# Altium project Control_Board_Model_C201.PrjPcb (part 2 of 8)

## Sheet MCU_Module.SchDoc: MCU Module
size A4; DocumentNumber: 4; SheetNumber: 4; SheetTotal: 50
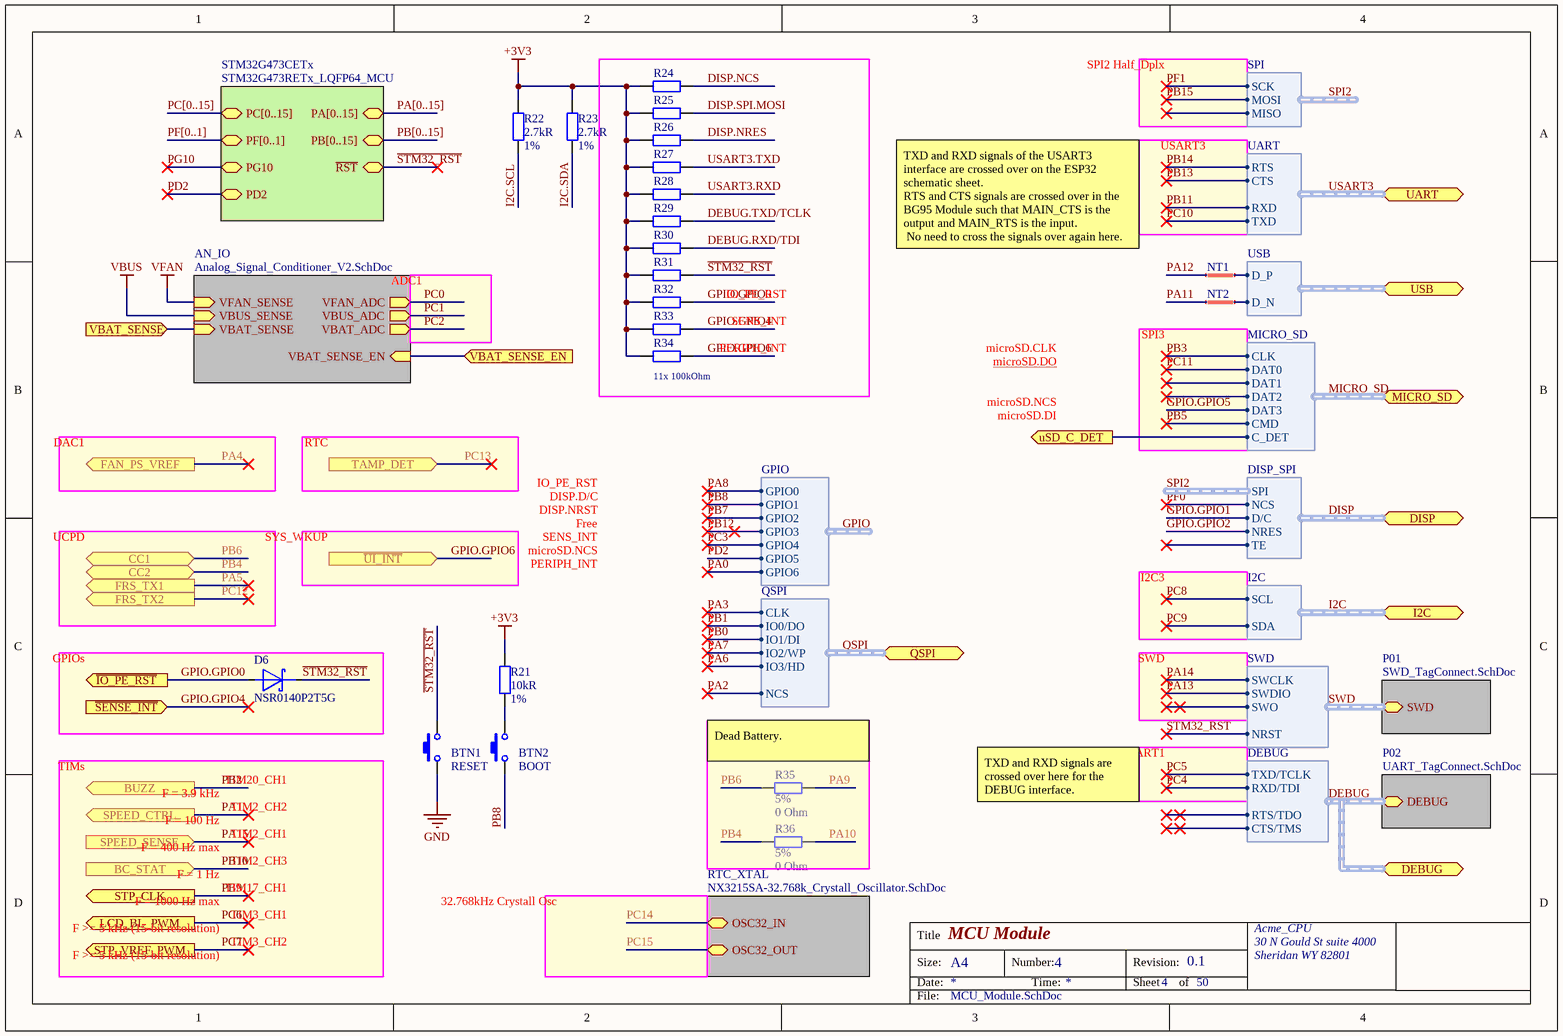
[diagram p3: MCU_Module.SchDoc]

### Parts
BTN1  RESET  [SWITCH USLPT2819DT2TR TACTILE TE]
BTN2  BOOT  [SWITCH USLPT2819DT2TR TACTILE TE]
D6  NSR0140P2T5G  [SODFL100X40-2N]
NT1  Net Tie  [Net Tie 6x30mil]  (value not drawn)  (net tie, no BOM)
NT2  Net Tie  [Net Tie 6x30mil]  (value not drawn)  (net tie, no BOM)
R21  Resistance: 10kR  Tolerance: 1%  [R0402]  (hidden comment: RES SMD 10K OHM 1% 1/16W 0402)
R22  Resistance: 2.7kR  Tolerance: 1%  [R0402]  (hidden comment: RES SMD 2.7K OHM 1% 1/16W 0402)
R23  Resistance: 2.7kR  Tolerance: 1%  [R0402]  (hidden comment: RES SMD 2.7K OHM 1% 1/16W 0402)
R24  RES SMD 100K OHM 1% 1/16W 0402  [R0402]  (value not drawn)
R25  RES SMD 100K OHM 1% 1/16W 0402  [R0402]  (value not drawn)
R26  RES SMD 100K OHM 1% 1/16W 0402  [R0402]  (value not drawn)
R27  RES SMD 100K OHM 1% 1/16W 0402  [R0402]  (value not drawn)
R28  RES SMD 100K OHM 1% 1/16W 0402  [R0402]  (value not drawn)
R29  RES SMD 100K OHM 1% 1/16W 0402  [R0402]  (value not drawn)
R30  RES SMD 100K OHM 1% 1/16W 0402  [R0402]  (value not drawn)
R31  RES SMD 100K OHM 1% 1/16W 0402  [R0402]  (value not drawn)
R32  RES SMD 100K OHM 1% 1/16W 0402  [R0402]  (value not drawn)
R33  RES SMD 100K OHM 1% 1/16W 0402  [R0402]  (value not drawn)
R34  RES SMD 100K OHM 1% 1/16W 0402  [R0402]  (value not drawn)
R35  Tolerance: 5%  Resistance: 0 Ohm  [R0402]  (hidden comment: RES SMD 0 OHM JUMPER 1/16W 0402)
R36  Tolerance: 5%  Resistance: 0 Ohm  [R0402]  (hidden comment: RES SMD 0 OHM JUMPER 1/16W 0402)

### Blocks framed on the sheet
GPIOs: D6

### Sub-sheets
AN_IO = Analog_Signal_Conditioner_V2.SchDoc: VFAN_SENSE (in), VBUS_SENSE (in), VBAT_SENSE (in), VBAT_ADC (out), VFAN_ADC (out), VBUS_ADC (out), VBAT_SENSE_EN (in)
P01 = SWD_TagConnect.SchDoc: SWD (harness SWD)  | Caption: SWD
P02 = UART_TagConnect.SchDoc (file not in this document): DEBUG (harness DEBUG)  | Caption: DEBUG
RTC_XTAL = NX3215SA-32.768k_Crystall_Oscillator.SchDoc: OSC32_OUT, OSC32_IN
STM32G473CETx = STM32G473RETx_LQFP64_MCU (file not in this document): ~{RST} (bidir), PA[0..15] (bidir), PB[0..15] (bidir), PC[0..15] (bidir), PF[0..1] (bidir), PG10 (bidir), PD2 (bidir)

### Ports
BC_STAT (in), BUZZ (out), CC1 (bidir), CC2 (bidir), DEBUG (harness DEBUG), DISP (harness DISP_SPI), FAN_PS_VREF (out), FRS_TX1 (out), FRS_TX2 (out), I2C (harness I2C), LCD_BL_PWM (out), MICRO_SD (harness MICRO_SD), QSPI (harness QSPI), SPEED_CTRL (out), SPEED_SENSE (in), STP_CLK (out), STP_VREF_PWM (out), TAMP_DET (in), UART (harness UART), USB (harness USB), uSD_C_DET (out), VBAT_SENSE (in), VBAT_SENSE_EN (in), ~{IO_PE_RST} (out), ~{SENSE_INT} (in), ~{UI_INT} (in)

### Harnesses
I2C: SCL, SDA
SWD: SWDIO, SWCLK, NRST, SWO
DEBUG: TXD/TCLK, RXD/TDI, RTS/TDO, CTS/TMS
GPIO: GPIO0, GPIO1, GPIO2, GPIO3, GPIO4, GPIO5, GPIO6
DISP_SPI: SPI, NCS, D/C, NRES, TE
MICRO_SD: DAT0, DAT1, DAT2, DAT3, CMD, CLK, C_DET
USB: D_P, D_N
SPI: SCK, MISO, MOSI
QSPI: IO0/DO, IO1/DI, NCS, CLK, IO2/WP, IO3/HD
UART: RTS, CTS, RXD, TXD

### Nets
+3V3: R21.1 R22.2 R23.2 R24.1 R25.1 R26.1 R27.1 R28.1 R29.1 R30.1 R31.1 R32.1 R33.1 R34.1
GND: BTN1.2
~{STM32_RST}: BTN1.1 D6.1(K) R31.2 ; sheet STM32G473CETx/~{RST}, sheet P01/SWD.NRST
DEBUG.RXD/TDI: R30.2
DEBUG.TXD/TCLK: R29.2
DIO_1_1: port uSD_C_DET, port MICRO_SD.C_DET
DIO_1_9: port VBAT_SENSE_EN, sheet AN_IO/VBAT_SENSE_EN
DISP.NCS: R24.2
DISP.NRES: R26.2
DISP.SPI.MOSI: R25.2
GPIO.GPIO0: D6.2(A) R32.2 ; port ~{IO_PE_RST}  [project net ~{IO_PE_RST}]
GPIO.GPIO1: port DISP.D/C  [project net DISP.D/C]
GPIO.GPIO2: port DISP.NRES  [project net DISP.NRES]
GPIO.GPIO4: R33.2 ; port ~{SENSE_INT}  [project net ~{SENS_INT}]
GPIO.GPIO5: port MICRO_SD.DAT3
GPIO.GPIO6: R34.2 ; port ~{UI_INT}  [project net ~{IO_SYS_INT}]
I2C.SCL: R22.1
I2C.SDA: R23.1
PA0: harness GPIO.GPIO6  [project net GPIO.GPIO6]
PA2: port QSPI.NCS
PA3: port QSPI.CLK
PA4: port FAN_PS_VREF  [project net FAN_PS_CTRL]
PA6: port QSPI.IO3/HD
PA7: port QSPI.IO2/WP
PA8: harness GPIO.GPIO0  [project net GPIO.GPIO0]
PA9: R35.2
PA10: R36.2
PA11: NT2.1
PA12: NT1.1
PA13: sheet P01/SWD.SWDIO
PA14: sheet P01/SWD.SWCLK
PB0: port QSPI.IO1/DI
PB1: port QSPI.IO0/DO
PB3: port MICRO_SD.CLK  [project net MICRO_SD.CLK]
PB4: R36.1 ; port CC2  [project net CC2]
PB5: port MICRO_SD.CMD  [project net MICRO_SD.CMD]
PB6: R35.1 ; port CC1  [project net CC1]
PB7: harness GPIO.GPIO2  [project net GPIO.GPIO2]
PB8: BTN2.2 ; harness GPIO.GPIO1  [project net GPIO.GPIO1]
PB9: port STP_CLK
PB11: port UART.RXD  [project net GPIO17]
PB12: harness GPIO.GPIO3  [project net GPIO.GPIO3]
PB13: port UART.CTS
PB14: port UART.RTS
PB15: harness SPI.MOSI
PC3: harness GPIO.GPIO4  [project net GPIO.GPIO4]
PC4: port DEBUG.RXD/TDI  [project net DEBUG.RXD/TDI]
PC5: port DEBUG.TXD/TCLK  [project net DEBUG.TXD/TCLK]
PC6: port LCD_BL_PWM  [project net LCD_BL_PWM]
PC7: port STP_VREF_PWM
PC8: port I2C.SCL  [project net GPIO4]
PC9: port I2C.SDA  [project net GPIO18]
PC10: port UART.TXD  [project net GPIO16]
PC11: port MICRO_SD.DAT0  [project net MICRO_SD.DAT0]
PD2: sheet STM32G473CETx/PD2, harness GPIO.GPIO5  [project net GPIO.GPIO5]
PF0: port DISP.NCS  [project net DISP.NCS]
PF1: harness SPI.SCK
PG10: sheet STM32G473CETx/PG10
USART3.RXD: R28.2
USART3.TXD: R27.2
USB1.D_N: NT2.2 ; port USB.D_N
USB1.D_P: NT1.2 ; port USB.D_P
VBAT: port VBAT_SENSE, sheet AN_IO/VBAT_SENSE
NetBTN2_1: BTN2.1 R21.2

### Buses and harness runs
bus PA[0..15] = sheet STM32G473CETx/PA[0..15]
bus PB[0..15] = sheet STM32G473CETx/PB[0..15]
bus PC[0..15] = sheet STM32G473CETx/PC[0..15]
bus PF[0..1] = sheet STM32G473CETx/PF[0..1]
harness DEBUG = port DEBUG = sheet P02/DEBUG
harness DISP = port DISP
harness I2C = port I2C
harness MICRO_SD = port MICRO_SD
harness QSPI = port QSPI
harness SWD = sheet P01/SWD
harness USART3 = port UART

### Notes on the sheet
- SPI2 Half_Dplx
- USART3
- TXD and RXD signals of the USART3 interface are crossed over on the ESP32 schematic sheet.
  RTS and CTS signals are crossed over in the BG95 Module such that MAIN_CTS is the output and MAIN_RTS is the input.
  No need to cross the signals over again here.
- ADC1
- IO_PE_RST
- (near R34) 11x 100kOhm
- PERIPH_INT
- SENS_INT
- microSD.CLK
- microSD.DO
- (near NT2) SPI3
- DAC1
- RTC
- microSD.NCS
- microSD.DI
- DISP.D/C
- DISP.NRST
- UCPD
- SYS_WKUP
- Free
- I2C3
- SWD
- TIMs
- TIM20_CH1
- (near R35) Dead Battery.
- USART1
- F = 3.9 kHz
- F = 100 Hz
- F = 400 Hz max
- TIM2_CH1
- TIM2_CH2
- TXD and RXD signals are crossed over here for the DEBUG interface.
- F = 1000 Hz max
- F = 1 Hz
- TIM17_CH1
- TIM3_CH1
- TIM2_CH3
- 32.768kHz Crystall Osc
- F >= 5 kHz (15-bit resolution)
- TIM3_CH2
- Title
- Size:
- Date:
- A4
- Number:
- Time:
- Revision:
- Sheet
- of
- File:

### Library data of the parts
BTN1 BTN2 = TACT ULTRA TB 2.8X1.9X0.6 160GF: Tactile Switch SPST-NO Top Actuated Surface Mount; Manufacturer: TE Connectivity; Manufacturer Part Number: USLPT2819DT2TR; Mechanical Life: 300000Cycles; Operating Force: 160gf; Throw Configuration: SPST; Illumination Type: Non-Illuminated; Switch Travel: 0.13mm; Switch Function: Off-Mom; Actuator Type: Standard; Actuator Material: Nylon,Polyamide; Supplier 1: Digi-Key; Stock 1: 7628; Pricing 1: 1=0.66, 10=0.636, 25=0.612, 100=0.5297, 250=0.4826, 500=0.4473, 1000=0.4002, 2500=0.379 (USD); Mount: Surface Mount; Min Operating Temperature: -40°C; Max Operating Temperature: 85°C; Packaging: Tape and Reel; Termination: SMD/SMT; ComponentLink1URL: https://www.te.com/commerce/DocumentDelivery/DDEController?Action=srchrtrv&amp;DocNm=2337225&amp;DocType=Customer+Drawing&amp;DocLang=English&src-supplier=Digi-Key; ComponentLink1Description: https://www.te.com/commerce/DocumentDelivery/DDEController?Action=srchrtrv&amp;DocNm=2337225&amp;DocType=Customer+Drawing&amp;DocLang=English&src-supplier=Digi-Key; Supplier Part Number 1: 450-3358-1-ND
D6 = DIODE SCHOTTKY 30V 70MA SOD923: as D2 on sheet USB_Type-C_Port_V2.0; Supplier 1: Digi-Key; Manufacturer Part Number: NSR0140P2T5G; Stock 1: 28802; Pricing 1: 1=0.36, 10=0.27, 25=0.2368, 100=0.1284, 500=0.1048, 1000=0.0777, 2500=0.0683 (USD); Case/Package: SOD-923-2; Number of Pins: 2; Contact Plating: Tin,Matte; Min Operating Temperature: -55°C; Max Operating Temperature: 125°C; Forward Current: 70mA; Package Quantity: 1; Packaging: Tape and Reel; Average Rectified Current: 70mA; Max Repetitive Reverse Voltage (Vrrm): 30V; Peak Reverse Current: 500nA; Power Dissipation: 100mW; Peak Non-Repetitive Surge Current: 500mA; Max Forward Surge Current (Ifsm): 500mA; Termination: SMD/SMT; Max Reverse Voltage (DC): 30V; Length: 0.85mm; Height: 0.43mm; Width: 0.65mm; Radiation Hardening: No; REACH SVHC: No SVHC; Lead Free: Lead Free; ComponentLink1URL: http://www.onsemi.com/pub_link/Collateral/NSR0140P2-D.PDF?src-supplier=Future+Electronics; ComponentLink1Description: http://www.onsemi.com/pub_link/Collateral/NSR0140P2-D.PDF?src-supplier=Future+Electronics; ComponentLink2URL: http://www.farnell.com/datasheets/2353885.pdf?src-supplier=Newark; ComponentLink2Description: http://www.farnell.com/datasheets/2353885.pdf?src-supplier=Newark; ComponentLink3URL: http://www.farnell.com/datasheets/86281.pdf?src-supplier=Element14; ComponentLink3Description: http://www.farnell.com/datasheets/86281.pdf?src-supplier=Element14; ComponentLink4URL: http://www.onsemi.com/pub/Collateral/NSR0140P2-D.PDF?src-supplier=Avnet; ComponentLink4Description: http://www.onsemi.com/pub/Collateral/NSR0140P2-D.PDF?src-supplier=Avnet; ComponentLink5URL: http://www.onsemi.com/pub/Collateral/NSR0140P2-D.PDF?src-supplier=Digi-Key; ComponentLink5Description: http://www.onsemi.com/pub/Collateral/NSR0140P2-D.PDF?src-supplier=Digi-Key; ComponentLink6URL: http://www.mouser.com/ds/2/308/NSR0140P2-D-115172.pdf?src-supplier=Mouser; ComponentLink6Description: http://www.mouser.com/ds/2/308/NSR0140P2-D-115172.pdf?src-supplier=Mouser; Supplier Part Number 1: NSR0140P2T5GOSCT-ND; ClassName: STM32G473CETx; Mount: Surface Mount
NT1 NT2 = Net Tie Line: ClassName: STM32G473CETx
R21 = RES SMD 10K OHM 1% 1/16W 0402: 10 kOhms ±1% 0.063W, 1/16W Chip Resistor 0402 (1005 Metric) Moisture Resistant Thick Film; Manufacturer Part Number: RC0402FR-0710KP; Manufacturer: Yageo; Temperature Coefficient: 150ppm/°C; Max Power Dissipation: 63mW; Supplier 1: Digi-Key; Stock 1: 839368; Pricing 1: 1=0.1, 10=0.035, 100=0.014, 1000=0.0063, 2500=0.0055, 5000=0.0045 (USD); Case Code (Imperial): 0402; Case Code (Metric): 1005; Min Operating Temperature: -55°C; Max Operating Temperature: 155°C; Composition: Thick Film; Packaging: Tape and Reel; Number of Terminations: 2; Length: 0.039inch; Height: 0.016inch; Width: 0.02inch; ComponentLink1URL: http://www.yageo.com/NewPortal/yageodocoutput?fileName=/pdf/R-Chip/PYu-RC_51_RoHS_P_0.pdf&src-supplier=Digi-Key; ComponentLink1Description: http://www.yageo.com/NewPortal/yageodocoutput?fileName=/pdf/R-Chip/PYu-RC_51_RoHS_P_0.pdf&src-supplier=Digi-Key; Supplier Part Number 1: YAG1249CT-ND; Case/Package: 0402; Features: Moisture Resistant; ClassName: STM32G473CETx; Mount: Surface Mount
R22 R23 = RES SMD 2.7K OHM 1% 1/16W 0402: 2.7 kOhms ±1% 0.063W, 1/16W Chip Resistor 0402 (1005 Metric) Moisture Resistant Thick Film; Manufacturer: Yageo; Manufacturer Part Number: RC0402FR-072K7L; Power Rating: 63mW; Temperature Coefficient: 100ppm/°C; Voltage Rating: 50V; Supplier 1: Digi-Key; Stock 1: 261850; Pricing 1: 1=0.1, 10=0.016, 100=0.0064, 1000=0.0029, 2500=0.0025, 5000=0.0021 (USD); Case/Package: 0402; Case Code (Imperial): 0402; Case Code (Metric): 1005; Min Operating Temperature: -55°C; Max Operating Temperature: 155°C; Packaging: Tape and Reel; Package Quantity: 1; Termination: SMD/SMT; Composition: Thick Film; Number of Terminations: 2; Military Standard: Not; Max Power Dissipation: 63mW; Features: Moisture Resistant; Working Voltage: 50V; Length: 1mm; Height: 0.016inch; Width: 0.02inch; Depth: 0.5mm; REACH SVHC: Unknown; Lead Free: Lead Free; ComponentLink1URL: http://www.mouser.com/ds/2/447/PYu-RC0402_51_RoHS_L_6_r-8721.pdf?src-supplier=Mouser; ComponentLink1Description: http://www.mouser.com/ds/2/447/PYu-RC0402_51_RoHS_L_6_r-8721.pdf?src-supplier=Mouser; ComponentLink2URL: http://www.yageo.com/documents/recent/PYu-RC_Group_51_RoHS_L_9.pdf?src-supplier=Digi-Key; ComponentLink2Description: http://www.yageo.com/documents/recent/PYu-RC_Group_51_RoHS_L_9.pdf?src-supplier=Digi-Key; ComponentLink3URL: http://www.yageo.com/documents/recent/PYu-RC_Group_51_RoHS_L_10.pdf?src-supplier=Digi-Key; ComponentLink3Description: http://www.yageo.com/documents/recent/PYu-RC_Group_51_RoHS_L_10.pdf?src-supplier=Digi-Key; ComponentLink4URL: http://www.farnell.com/datasheets/2167052.pdf?src-supplier=Element14; ComponentLink4Description: http://www.farnell.com/datasheets/2167052.pdf?src-supplier=Element14; Supplier Part Number 1: 311-2.70KLRCT-ND; ClassName: STM32G473CETx; Mount: Surface Mount
R24-R34 = RES SMD 100K OHM 1% 1/16W 0402: as R2 on sheet USB_Type-C_Port_V2.0; Supplier 1: Digi-Key; Stock 1: 47448883; Pricing 1: 1=0.1, 10=0.016, 100=0.0064, 1000=0.0029, 2500=0.0025, 5000=0.0021 (USD); Case Code (Metric): 1005; Case Code (Imperial): 0402; Min Operating Temperature: -55°C; Max Operating Temperature: 155°C; Composition: Thick Film; Packaging: Tape and Reel; Termination: SMD/SMT; Military Standard: Not; Length: 0.039inch; Height: 0.016inch; Width: 0.02inch; Depth: 0.5mm; Lead Free: Lead Free; ComponentLink1URL: http://www.yageo.com/documents/recent/PYu-RC_Group_51_RoHS_L_10.pdf?src-supplier=Digi-Key; ComponentLink1Description: http://www.yageo.com/documents/recent/PYu-RC_Group_51_RoHS_L_10.pdf?src-supplier=Digi-Key; ComponentLink2URL: http://www.farnell.com/datasheets/1018594.pdf?src-supplier=Element14; ComponentLink2Description: http://www.farnell.com/datasheets/1018594.pdf?src-supplier=Element14; ComponentLink3URL: http://www.yageo.com/documents/recent/PYu-RC_Group_51_RoHS_L_9.pdf?src-supplier=Verical; ComponentLink3Description: http://www.yageo.com/documents/recent/PYu-RC_Group_51_RoHS_L_9.pdf?src-supplier=Verical; Supplier Part Number 1: 311-100KLRDKR-ND; Case/Package: 0402; Tolerance: 1%; Resistance: 100 kOhm; Package Quantity: 1; Number of Terminations: 2; Max Power Dissipation: 63mW; Working Voltage: 50V; Features: Moisture Resistant; REACH SVHC: No SVHC; ComponentLink4URL: http://www.yageo.com/documents/recent/PYu-RC_Group_51_RoHS_L_9.pdf?src-supplier=Mouser; ComponentLink4Description: http://www.yageo.com/documents/recent/PYu-RC_Group_51_RoHS_L_9.pdf?src-supplier=Mouser; ComponentLink5URL: http://documents.rs-components.com/techlib://itc_doclist_GB.htm?stockno=6185797&src-supplier=RSComponents; ComponentLink5Description: http://documents.rs-components.com/techlib://itc_doclist_GB.htm?stockno=6185797&src-supplier=RSComponents; Mount: Surface Mount
R35 R36 = RES SMD 0 OHM JUMPER 1/16W 0402: as R1 on sheet Top_Control_Board_Model_C201; Case/Package: 0402; Supplier 1: Digi-Key; Stock 1: 46057148; Pricing 1: 1=0.1, 10=0.013, 25=0.0092, 50=0.0072, 100=0.0053, 250=0.004, 500=0.0032, 1000=0.0024, 5000=0.0017 (USD); Contact Plating: Tin,Matte; Case Code (Metric): 1005; Case Code (Imperial): 0402; Min Operating Temperature: -55°C; Max Operating Temperature: 155°C; Packaging: Tape and Reel; Composition: Thick Film; Package Quantity: 1; Number of Terminations: 2; Termination: SMD/SMT; Military Standard: Not; Features: Moisture Resistant; Length: 1mm; Height: 0.016inch; Width: 0.02inch; Depth: 0.5mm; Radiation Hardening: No; REACH SVHC: Unknown; Lead Free: Lead Free; ComponentLink1URL: http://www.yageo.com/documents/recent/PYu-RC_Group_51_RoHS_L_10.pdf?src-supplier=Digi-Key; ComponentLink1Description: http://www.yageo.com/documents/recent/PYu-RC_Group_51_RoHS_L_10.pdf?src-supplier=Digi-Key; ComponentLink2URL: http://www.yageo.com/documents/recent/PYu-RC0402_51_RoHS_L_6.pdf?src-supplier=Avnet+Europe; ComponentLink2Description: http://www.yageo.com/documents/recent/PYu-RC0402_51_RoHS_L_6.pdf?src-supplier=Avnet+Europe; ComponentLink3URL: http://www.farnell.com/datasheets/1018594.pdf?src-supplier=Element14; ComponentLink3Description: http://www.farnell.com/datasheets/1018594.pdf?src-supplier=Element14; ComponentLink4URL: https://www.verical.com/server-webapp/html/getDatasheet?partID=326379&src-supplier=Verical; ComponentLink4Description: https://www.verical.com/server-webapp/html/getDatasheet?partID=326379&src-supplier=Verical; ComponentLink5URL: http://www.farnell.com/datasheets/2167052.pdf?src-supplier=Element14; ComponentLink5Description: http://www.farnell.com/datasheets/2167052.pdf?src-supplier=Element14; Supplier Part Number 1: 311-0.0JRCT-ND; ClassName: STM32G473CETx; Mount: Surface Mount

## Sheet SWD_TagConnect.SchDoc: Tag-Connect SWD Port
size A4; DocumentNumber: 5; SheetNumber: 5; SheetTotal: 50
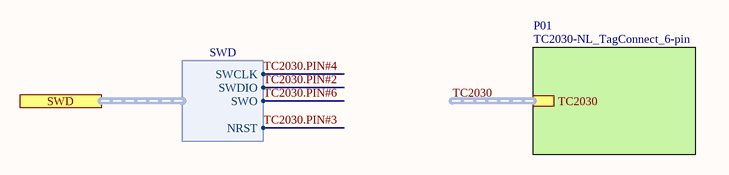
[diagram p4: SWD_TagConnect.SchDoc]

### Sub-sheets
P01 = TC2030-NL_TagConnect_6-pin (file not in this document): TC2030 (harness TC2030)

### Ports
SWD (harness SWD)

### Harnesses
SWD: SWDIO, SWCLK, NRST, SWO

### Buses and harness runs
harness TC2030 = sheet P01/TC2030

### Notes on the sheet
- Title
- Size:
- Date:
- A4
- Number:
- Time:
- Revision:
- Sheet
- of
- File:

## Sheet NX3215SA-32.768k_Crystall_Oscillator.SchDoc: NX3215SA-32.768K Crystall Oscillator
size A4; DocumentNumber: 7; SheetNumber: 7; SheetTotal: 50
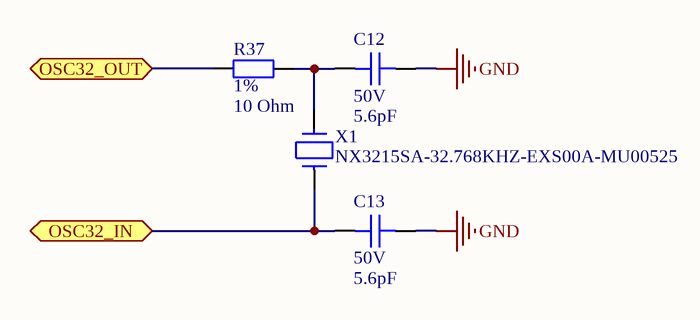
[diagram p5: NX3215SA-32.768k_Crystall_Oscillator.SchDoc]

### Parts
C12  Voltage Rating: 50V  Capacitance: 5.6pF  [C0402]  (hidden comment: CAP CER 5.6PF 50V NPO 0402)
C13  Voltage Rating: 50V  Capacitance: 5.6pF  [C0402]  (hidden comment: CAP CER 5.6PF 50V NPO 0402)
R37  Tolerance: 1%  Resistance: 10 Ohm  [R0402]  (hidden comment: RES SMD 10 OHM 1% 1/16W 0402)
X1  NX3215SA-32.768KHZ-EXS00A-MU00525  [XTAL_2SM_3R2X1R5]

### Ports
OSC32_IN, OSC32_OUT

### Nets
GND: C12.1 C13.1
PC14: C13.2 X1.1 ; port OSC32_IN
PC15: R37.2 ; port OSC32_OUT
NetC12_2: C12.2 R37.1 X1.2

### Notes on the sheet
- Title
- Size:
- Date:
- A4
- Number:
- Time:
- Revision:
- Sheet
- of
- File:

### Library data of the parts
C12 C13 = CAP CER 5.6PF 50V NPO 0402: 5.6pF ±0.25pF 50V Ceramic Capacitor C0G, NP0 0402 (1005 Metric); Manufacturer: Yageo; Manufacturer Part Number: AC0402CRNPO9BN5R6; Supplier 1: Digi-Key; Stock 1: 39931; Pricing 1: 1=0.12, 10=0.084, 100=0.0397, 500=0.0278, 1000=0.023, 2500=0.0214, 5000=0.0196 (USD); Mount: Surface Mount; Min Operating Temperature: -55°C; Max Operating Temperature: 125°C; Packaging: Cut Tape; Ratings: AEC-Q200; ComponentLink1URL: http://www.yageo.com/documents/recent/UPY-AC_NP0X7R_16V-to-630V_11.pdf?src-supplier=Digi-Key; ComponentLink1Description: http://www.yageo.com/documents/recent/UPY-AC_NP0X7R_16V-to-630V_11.pdf?src-supplier=Digi-Key; ComponentLink2URL: http://www.yageo.com/documents/recent/UPY-AC_NP0X7R_16V-to-630V_12.pdf?src-supplier=Digi-Key; ComponentLink2Description: http://www.yageo.com/documents/recent/UPY-AC_NP0X7R_16V-to-630V_12.pdf?src-supplier=Digi-Key; Supplier Part Number 1: 311-3056-1-ND; Case/Package: 0402; ClassName: STM32G473CETx
R37 = RES SMD 10 OHM 1% 1/16W 0402: 10 Ohms ±1% 0.063W, 1/16W Chip Resistor 0402 (1005 Metric) Automotive AEC-Q200, Moisture Resistant Thick Film; Manufacturer Part Number: AC0402FR-0710RL; Manufacturer: Yageo; Power Rating: 62.5mW; Voltage Rating: 50V; Max Power Dissipation: 63mW; Temperature Coefficient: 200ppm/°C; Supplier 1: Digi-Key; Stock 1: 212882; Pricing 1: 1=0.1, 10=0.03, 100=0.012, 1000=0.0054, 2500=0.0047, 5000=0.0039 (USD); Case/Package: 0402; Case Code (Imperial): 0402; Case Code (Metric): 1005; Min Operating Temperature: -55°C; Max Operating Temperature: 155°C; Packaging: Tape and Reel; Composition: Thick Film; Number of Terminations: 2; Termination: SMD/SMT; Features: Moisture Resistant,Automotive AEC-Q200; Length: 0.039inch; Height: 0.015inch; Width: 0.02inch; Lead Free: Lead Free; ComponentLink1URL: http://www.yageo.com/documents/recent/PYu-AC_51_RoHS_L_2_revised.pdf?src-supplier=Future+Electronics; ComponentLink1Description: http://www.yageo.com/documents/recent/PYu-AC_51_RoHS_L_2_revised.pdf?src-supplier=Future+Electronics; ComponentLink2URL: http://www.yageo.com/NewPortal/yageodocoutput?fileName=/pdf/R-Chip/PYu-AC_51_RoHS_L_6.pdf&src-supplier=Digi-Key; ComponentLink2Description: http://www.yageo.com/NewPortal/yageodocoutput?fileName=/pdf/R-Chip/PYu-AC_51_RoHS_L_6.pdf&src-supplier=Digi-Key; ComponentLink3URL: http://www.mouser.com/ds/2/447/yageodocoutput-1111992.pdf?src-supplier=Mouser; ComponentLink3Description: http://www.mouser.com/ds/2/447/yageodocoutput-1111992.pdf?src-supplier=Mouser; Supplier Part Number 1: YAG3438CT-ND; ClassName: STM32G473CETx; Mount: Surface Mount
X1 = CRYSTAL 32.768KHZ 6PF SMD: 32.768kHz  Crystal 6pF 70 kOhms 2-SMD, No Lead; Manufacturer: NDK; ESR (Equivalent Series Resistance): 70kR; Supplier 1: Digi-Key; Manufacturer Part Number: NX3215SA-32.768KHZ-EXS00A-MU00525; Stock 1: 5687; Pricing 1: 1=0.68, 10=0.602, 50=0.5628, 100=0.4974, 500=0.4712, 1000=0.3927 (USD); Mount: Surface Mount; Case/Package: SMD/SMT; Min Operating Temperature: -40°C; Max Operating Temperature: 85°C; Packaging: Tape and Reel; Frequency: 32.768kHz; Load Capacitance: 6pF; Ratings: AEC-Q200; Supplier Part Number 1: 644-1386-1-ND; ClassName: STM32G473CETx

## Sheet Analog_Signal_Conditioner_V2.SchDoc: Analog Signal Conditioner
size A4; DocumentNumber: 8; SheetNumber: 8; SheetTotal: 50
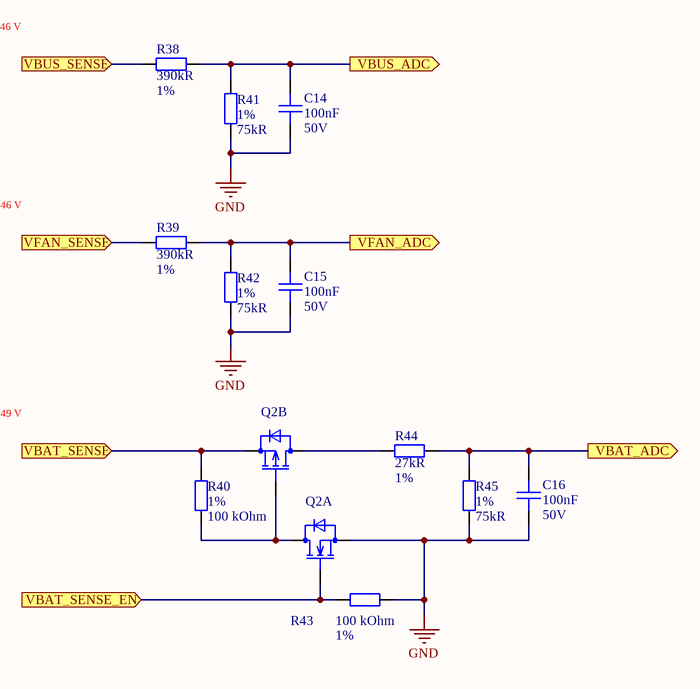
[diagram p6: Analog_Signal_Conditioner_V2.SchDoc]

### Parts
C14  Capacitance: 100nF  Voltage: 50V  [C0402]  (hidden comment: CAP CER 0.1UF 50V X7R 0402)
C15  Capacitance: 100nF  Voltage: 50V  [C0402]  (hidden comment: CAP CER 0.1UF 50V X7R 0402)
C16  Capacitance: 100nF  Voltage: 50V  [C0402]  (hidden comment: CAP CER 0.1UF 50V X7R 0402)
Q2  EM6M2T2R  [SON_400UV-7_DIO]  (value not drawn)  (parts A,B of 2)
R38  Resistance: 390kR  Tolerance: 1%  [R0402]  (hidden comment: RES SMD 390K OHM 1% 1/16W 0402)
R39  Resistance: 390kR  Tolerance: 1%  [R0402]  (hidden comment: RES SMD 390K OHM 1% 1/16W 0402)
R40  Tolerance: 1%  Resistance: 100 kOhm  [R0402]  (hidden comment: RES SMD 100K OHM 1% 1/16W 0402)
R41  Tolerance: 1%  Resistance: 75kR  [R0402]  (hidden comment: RES SMD 75K OHM 1% 1/16W 0402)
R42  Tolerance: 1%  Resistance: 75kR  [R0402]  (hidden comment: RES SMD 75K OHM 1% 1/16W 0402)
R43  Tolerance: 1%  Resistance: 100 kOhm  [R0402]  (hidden comment: RES SMD 100K OHM 1% 1/16W 0402)
R44  Resistance: 27kR  Tolerance: 1%  [R0402]  (hidden comment: RES SMD 27K OHM 1% 1/16W 0402)
R45  Tolerance: 1%  Resistance: 75kR  [R0402]  (hidden comment: RES SMD 75K OHM 1% 1/16W 0402)

### Ports
VBAT_ADC (out), VBAT_SENSE (in), VBAT_SENSE_EN (in), VBUS_ADC (out), VBUS_SENSE (in), VFAN_ADC (out), VFAN_SENSE (in)

### Nets
GND: C14.1 C15.1 C16.1 Q2.1(S) R41.1 R42.1 R43.1 R45.1
VBUS: R38.1 ; port VBUS_SENSE
VFAN: R39.1 ; port VFAN_SENSE
DIO_1_9: Q2.2(G) R43.2 ; port VBAT_SENSE_EN
PC0: C15.2 R39.2 R42.2 ; port VFAN_ADC
PC1: C14.2 R38.2 R41.2 ; port VBUS_ADC
PC2: C16.2 R44.2 R45.2 ; port VBAT_ADC
VBAT: Q2.4(S) R40.2 ; port VBAT_SENSE
NetQ2_3: Q2.3(D) R44.1
NetQ2_5: Q2.5(G) Q2.6(D) R40.1

### Notes on the sheet
- (near R38) VBUS_SENSE max = 20.46 V
- (near R39) VFAN_SENSE max = 20.46 V
- VBAT_SENSE max = 4.49 V
- Title
- Size:
- Date:
- A4
- Number:
- Time:
- Revision:
- Sheet
- of
- File:

### Library data of the parts
C14-C16 = CAP CER 0.1UF 50V X7R 0402: 0.1µF ±10% 50V Ceramic Capacitor X7R 0402 (1005 Metric); Manufacturer Part Number: CGA2B3X7R1H104K050BB; Manufacturer: TDK; Supplier 1: Digi-Key; Stock 1: 2925303; Pricing 1: 1=0.17, 10=0.118, 50=0.0668, 100=0.0553, 500=0.0388, 1000=0.0321, 2500=0.0299, 5000=0.0273 (USD); Mount: Surface Mount; Case Code (Metric): 1005; Case Code (Imperial): 0402; Min Operating Temperature: -55°C; Max Operating Temperature: 125°C; Tolerance: 10%; Dielectric: X7R; Voltage Rating: 50V; Voltage Rating (DC): 50V; Packaging: Tape and Reel; Package Quantity: 1; Termination: SMD/SMT; Composition: Ceramic; Length: 1mm; Height: 0.5mm; Width: 0.02inch; Thickness: 0.022inch; Depth: 0.5mm; REACH SVHC: No SVHC; Lead Free: Lead Free; ComponentLink1URL: http://product.tdk.com/capacitor/mlcc/en/documents/mlccspec_automotive_general_midvoltage_en.pdf?src-supplier=Future+Electronics; ComponentLink1Description: http://product.tdk.com/capacitor/mlcc/en/documents/mlccspec_automotive_general_midvoltage_en.pdf?src-supplier=Future+Electronics; ComponentLink2URL: http://www.farnell.com/datasheets/1807242.pdf?src-supplier=Element14; ComponentLink2Description: http://www.farnell.com/datasheets/1807242.pdf?src-supplier=Element14; ComponentLink3URL: http://www.mouser.com/ds/2/400/lcc_automotive_general_en-843974.pdf?src-supplier=Mouser; ComponentLink3Description: http://www.mouser.com/ds/2/400/lcc_automotive_general_en-843974.pdf?src-supplier=Mouser; ComponentLink4URL: http://www.farnell.com/datasheets/1936565.pdf?src-supplier=Element14; ComponentLink4Description: http://www.farnell.com/datasheets/1936565.pdf?src-supplier=Element14; ComponentLink5URL: http://www.farnell.com/datasheets/1735392.pdf?src-supplier=Element14; ComponentLink5Description: http://www.farnell.com/datasheets/1735392.pdf?src-supplier=Element14; Supplier Part Number 1: 445-6899-1-ND; Case/Package: 0402; Weight: 2.3E-05oz; Ratings: AEC-Q200; ClassName: STM32G473CETx
Q2 = ARRAY MOSFET N/P-CH 20V 0.2A EMT6: Mosfet Array N and P-Channel 20V 200mA 150mW Surface Mount EMT6; Manufacturer: Rohm; Rds On Max: 1R; Input Capacitance: 25pF; Supplier 1: Digi-Key; Manufacturer Part Number: EM6M2T2R; Stock 1: 84378; Pricing 1: 1=0.44, 10=0.375, 25=0.35, 100=0.26, 250=0.247, 500=0.203, 1000=0.165, 2500=0.155 (USD); Mount: Surface Mount; Case/Package: SOT-23-5; Number of Pins: 6; Min Operating Temperature: -55°C; Max Operating Temperature: 150°C; Packaging: Tape and Reel; Package Quantity: 1; Drain to Source Voltage (Vdss): 20V; Continuous Drain Current (ID): 200mA; Max Power Dissipation: 150mW; Drain to Source Resistance: 1R; FET Type: N and P-Channel; Radiation Hardening: No; Lead Free: Lead Free; ComponentLink1URL: http://rohmfs.rohm.com/en/techdata_basic/transistor/taping/EMT6_T2R_taping.pdf?src-supplier=Digi-Key; ComponentLink1Description: http://rohmfs.rohm.com/en/techdata_basic/transistor/taping/EMT6_T2R_taping.pdf?src-supplier=Digi-Key; Supplier Part Number 1: EM6M2T2RCT-ND; ClassName: STM32G473CETx
R38 R39 = RES SMD 390K OHM 1% 1/16W 0402: 390 kOhms ±1% 0.063W, 1/16W Chip Resistor 0402 (1005 Metric) Moisture Resistant Thick Film; Manufacturer: Yageo; Manufacturer Part Number: RC0402FR-07390KL; Power Rating: 62.5mW; Voltage Rating: 50V; Temperature Coefficient: 100ppm/°C; Max Power Dissipation: 63mW; Supplier 1: Digi-Key; Stock 1: 118017; Pricing 1: 1=0.1, 10=0.016, 100=0.0064, 1000=0.0029, 2500=0.0025, 5000=0.0021 (USD); Case/Package: 0402; Weight: 2.3E-05oz; Case Code (Imperial): 0402; Case Code (Metric): 1005; Min Operating Temperature: -55°C; Max Operating Temperature: 155°C; Packaging: Tape and Reel; Composition: Thick Film; Number of Terminations: 2; Termination: SMD/SMT; Military Standard: Not; Features: Moisture Resistant; Length: 1mm; Height: 0.016inch; Width: 0.02inch; Depth: 0.5mm; REACH SVHC: Unknown; Lead Free: Lead Free; ComponentLink1URL: http://www.yageo.com/documents/recent/PYu-RC0402_51_RoHS_L_6.pdf?src-supplier=Future+Electronics; ComponentLink1Description: http://www.yageo.com/documents/recent/PYu-RC0402_51_RoHS_L_6.pdf?src-supplier=Future+Electronics; ComponentLink2URL: http://www.farnell.com/datasheets/2167052.pdf?src-supplier=Element14; ComponentLink2Description: http://www.farnell.com/datasheets/2167052.pdf?src-supplier=Element14; ComponentLink3URL: http://www.mouser.com/ds/2/447/PYu-RC0402_51_RoHS_L_6_r-8721.pdf?src-supplier=Mouser; ComponentLink3Description: http://www.mouser.com/ds/2/447/PYu-RC0402_51_RoHS_L_6_r-8721.pdf?src-supplier=Mouser; Supplier Part Number 1: YAG3143CT-ND; ClassName: STM32G473CETx; Mount: Surface Mount
R40 R43 = RES SMD 100K OHM 1% 1/16W 0402: as R2 on sheet USB_Type-C_Port_V2.0; Supplier 1: Digi-Key; Stock 1: 47448883; Pricing 1: 1=0.1, 10=0.016, 100=0.0064, 1000=0.0029, 2500=0.0025, 5000=0.0021 (USD); Case Code (Metric): 1005; Case Code (Imperial): 0402; Min Operating Temperature: -55°C; Max Operating Temperature: 155°C; Composition: Thick Film; Packaging: Tape and Reel; Package Quantity: 1; Number of Terminations: 2; Termination: SMD/SMT; Military Standard: Not; Max Power Dissipation: 63mW; Working Voltage: 50V; Features: Moisture Resistant; Length: 0.039inch; Height: 0.016inch; Width: 0.02inch; Depth: 0.5mm; REACH SVHC: No SVHC; Lead Free: Lead Free; ComponentLink1URL: http://www.yageo.com/documents/recent/PYu-RC_Group_51_RoHS_L_10.pdf?src-supplier=Digi-Key; ComponentLink1Description: http://www.yageo.com/documents/recent/PYu-RC_Group_51_RoHS_L_10.pdf?src-supplier=Digi-Key; ComponentLink2URL: http://www.farnell.com/datasheets/1018594.pdf?src-supplier=Element14; ComponentLink2Description: http://www.farnell.com/datasheets/1018594.pdf?src-supplier=Element14; ComponentLink3URL: http://www.yageo.com/documents/recent/PYu-RC_Group_51_RoHS_L_9.pdf?src-supplier=Verical; ComponentLink3Description: http://www.yageo.com/documents/recent/PYu-RC_Group_51_RoHS_L_9.pdf?src-supplier=Verical; ComponentLink4URL: http://www.yageo.com/documents/recent/PYu-RC_Group_51_RoHS_L_9.pdf?src-supplier=Mouser; ComponentLink4Description: http://www.yageo.com/documents/recent/PYu-RC_Group_51_RoHS_L_9.pdf?src-supplier=Mouser; ComponentLink5URL: http://documents.rs-components.com/techlib://itc_doclist_GB.htm?stockno=6185797&src-supplier=RSComponents; ComponentLink5Description: http://documents.rs-components.com/techlib://itc_doclist_GB.htm?stockno=6185797&src-supplier=RSComponents; Supplier Part Number 1: 311-100KLRDKR-ND; Case/Package: 0402; ClassName: STM32G473CETx; Mount: Surface Mount
R41 R42 R45 = RES SMD 75K OHM 1% 1/16W 0402: 75 kOhms ±1% 0.063W, 1/16W Chip Resistor 0402 (1005 Metric) Automotive AEC-Q200 Thick Film; Manufacturer: Stackpole Electronics; Manufacturer Part Number: RMCF0402FT75K0; Power Rating: 63mW; Temperature Coefficient: 100ppm/°C; Supplier 1: Digi-Key; Stock 1: 24693; Pricing 1: 1=0.1, 10=0.014, 100=0.0058, 1000=0.0026, 2500=0.0023, 5000=0.0019 (USD); Mount: Surface Mount; Case/Package: 0402; Case Code (Metric): 1005; Case Code (Imperial): 0402; Contact Plating: Tin,Matte; Min Operating Temperature: -55°C; Max Operating Temperature: 155°C; Features: Automotive AEC-Q200; Packaging: Tape and Reel; Composition: Thick Film; Number of Terminations: 2; Military Standard: Not; Max Power Dissipation: 63mW; Length: 0.039inch; Height: 0.016inch; Width: 0.02inch; Depth: 0.5mm; Radiation Hardening: No; Lead Free: Lead Free; ComponentLink1URL: https://www.seielect.com/catalog/SEI-Packaging.pdf?src-supplier=Digi-Key; ComponentLink1Description: https://www.seielect.com/catalog/SEI-Packaging.pdf?src-supplier=Digi-Key; ComponentLink2URL: http://www.seielect.com/Catalog/Sei-RMC.pdf?src-supplier=Future+Electronics; ComponentLink2Description: http://www.seielect.com/Catalog/Sei-RMC.pdf?src-supplier=Future+Electronics; ComponentLink3URL: https://www.seielect.com/catalog/SEI-RMCF_RMCP.pdf?src-supplier=Avnet; ComponentLink3Description: https://www.seielect.com/catalog/SEI-RMCF_RMCP.pdf?src-supplier=Avnet; ComponentLink4URL: http://components.arrow.com/part/dataview/47811039S7743759N1174?src-supplier=Arrow; ComponentLink4Description: http://components.arrow.com/part/dataview/47811039S7743759N1174?src-supplier=Arrow; ComponentLink5URL: https://www.verical.com/server-webapp/html/getDatasheet?partID=492569&src-supplier=Verical; ComponentLink5Description: https://www.verical.com/server-webapp/html/getDatasheet?partID=492569&src-supplier=Verical; Supplier Part Number 1: RMCF0402FT75K0CT-ND; ClassName: STM32G473CETx
R44 = RES SMD 27K OHM 1% 1/16W 0402: 27 kOhms ±1% 0.063W, 1/16W Chip Resistor 0402 (1005 Metric) Moisture Resistant Thick Film; Manufacturer: Yageo; Manufacturer Part Number: RC0402FR-0727KL; Power Rating: 63mW; Voltage Rating: 50V; Temperature Coefficient: 100ppm/°C; Supplier 1: Digi-Key; Stock 1: 1508379; Pricing 1: 1=0.1, 10=0.016, 100=0.0064, 1000=0.0029, 2500=0.0025, 5000=0.0021 (USD); Case/Package: 0402; Case Code (Imperial): 0402; Case Code (Metric): 1005; Min Operating Temperature: -55°C; Max Operating Temperature: 155°C; Packaging: Tape and Reel; Composition: Thick Film; Number of Terminations: 2; Termination: SMD/SMT; Military Standard: Not; Max Power Dissipation: 63mW; Features: Moisture Resistant; Length: 1mm; Height: 0.016inch; Width: 0.02inch; Depth: 0.5mm; Lead Free: Lead Free; ComponentLink1URL: http://www.farnell.com/datasheets/2167052.pdf?src-supplier=Element14; ComponentLink1Description: http://www.farnell.com/datasheets/2167052.pdf?src-supplier=Element14; ComponentLink2URL: http://documents.rs-components.com/techlib://itc_doclist_GB.htm?stockno=6186475&src-supplier=RSComponents; ComponentLink2Description: http://documents.rs-components.com/techlib://itc_doclist_GB.htm?stockno=6186475&src-supplier=RSComponents; ComponentLink3URL: http://www.yageo.com/documents/recent/PYu-RC_Group_51_RoHS_L_10.pdf?src-supplier=Digi-Key; ComponentLink3Description: http://www.yageo.com/documents/recent/PYu-RC_Group_51_RoHS_L_10.pdf?src-supplier=Digi-Key; Supplier Part Number 1: 311-27.0KLRCT-ND; ComponentLink4URL: http://www.yageo.com/documents/recent/PYu-RC0402_51_RoHS_L_6_r.pdf?src-supplier=Future+Electronics; ComponentLink4Description: http://www.yageo.com/documents/recent/PYu-RC0402_51_RoHS_L_6_r.pdf?src-supplier=Future+Electronics; Package Quantity: 10000; REACH SVHC: Unknown; ClassName: STM32G473CETx; Mount: Surface Mount